# EAGLE schematic ESP_Breakout (EAGLE 9.2.0)
COMPANY: ADAFRUIT INDUSTRIES; DRAWN: KTOWN; REV: B
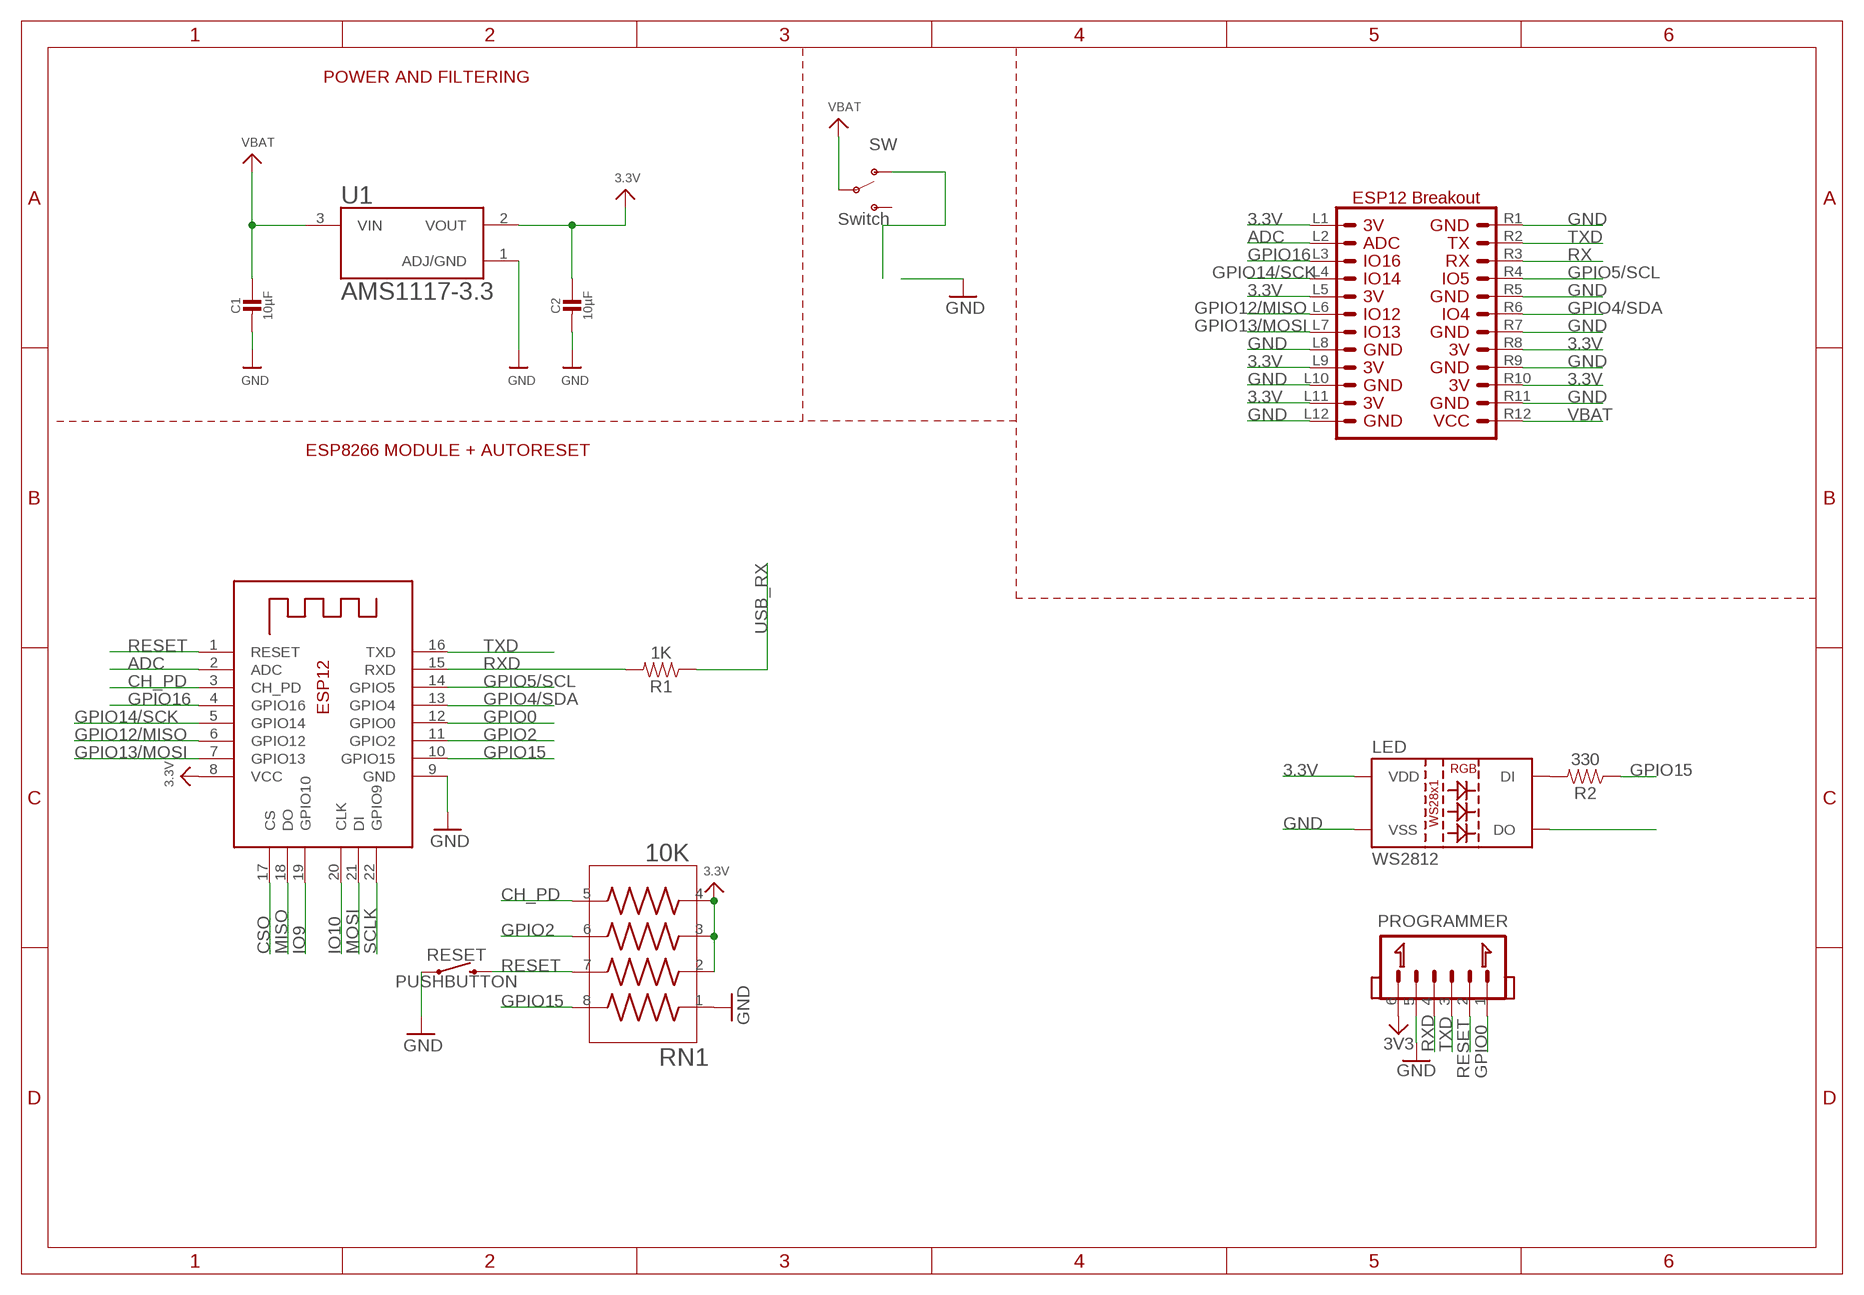
[diagram p0: schematic, sheet 1]

## Parts
C1  10µF  CAP_CERAMIC_0603  [CAP_0603]
C2  10µF  CAP_CERAMIC_0603  [CAP_0603]
LED  WS2812  [LED-TRICOLOR-5050-IC]
PROGRAMMER  JST_1.25_6P  [JST1.25_6P]
R1  1K  RESISTOR0603  [0603]
R2  330  RESISTOR0603  [0603]
RESET  PUSHBUTTON  [TACTILE_SWITCH_SMD_6.0X3.5MM]
RN1  10K  RESISTOR_ARRAY_1206  [RESCAF80P320X160X60-8N]
SW  Switch  SWITCH_SPDT_SLIDE  [SWITCH_SPDT_PTH_11.6X4.0MM]
U1  AMS1117-3.3  [SOT229P700X180-4N]
U$7  ESP12_BREAKOUT  [ESP12_BREAKOUT_CONN]
X2  ESP-12  ESP-12E  [ESP-12E]

## Nets
3.3V: C2.1 LED.VDD PROGRAMMER.6 RN1.2 RN1.3 RN1.4 U1.2(VOUT) U$7.L1 U$7.L5 U$7.L9 U$7.L11 U$7.R8 U$7.R10 X2.8(VCC) ; supply symbol labelled SUPPLY_3.3V
ADC: U$7.L2 X2.2(ADC)
CH_PD: RN1.5 X2.3(CH_PD)
CSO: X2.17(CS)
GND: C1.2 C2.2 LED.VSS PROGRAMMER.5 RESET.1 RN1.1 U1.1(ADJ/GND) U$7.L8 U$7.L10 U$7.L12 U$7.R1 U$7.R5 U$7.R7 U$7.R9 U$7.R11 X2.9(GND) ; supply symbol labelled SUPPLY_GND
GPIO0: PROGRAMMER.1 X2.12(GPIO0)
GPIO2: RN1.6 X2.11(GPIO2)
GPIO4/SDA: U$7.R6 X2.13(GPIO4)
GPIO5/SCL: U$7.R4 X2.14(GPIO5)
GPIO12/MISO: U$7.L6 X2.6(GPIO12)
GPIO13/MOSI: U$7.L7 X2.7(GPIO13)
GPIO14/SCK: U$7.L4 X2.5(GPIO14)
GPIO15: R2.1 RN1.8 X2.10(GPIO15)
GPIO16: U$7.L3 X2.4(GPIO16)
IO9: X2.19(GPIO10)
IO10: X2.20(CLK)
MISO: X2.18(DO)
MOSI: X2.21(DI)
N$1: SW.1(O)
N$2: LED.DIN(DI) R2.2
N$5: LED.DOUT(DO)
RESET: PROGRAMMER.2 RESET.2 RN1.7 X2.1(RESET)
RX: U$7.R3
RXD: PROGRAMMER.4 R1.2 X2.15(RXD)
SCLK: X2.22(GPIO9)
TXD: PROGRAMMER.3 U$7.R2 X2.16(TXD)
USB_RX: R1.1
VBAT: C1.1 SW.2(P) U1.3(VIN) U$7.R12
Unconnected: SW.3(S)

## Notes on the sheet
- POWER AND FILTERING
- ESP8266 MODULE + AUTORESET

## Library data of the parts
C1 C2 = Scott-Electrical:CAP_CERAMIC
LED = AutoPark:WS2812
PROGRAMMER = Scott-Connectors:JST_1.25_6P
R1 R2 = Scott-Electrical:RESISTOR: Generic Resistor Package
RESET = AutoPark:PUSHBUTTON
RN1 = AutoPark:RESISTOR_ARRAY_1206: Res Thick Film Array 75 Ohm 5% 0.25W(1/4W) ?200ppm/C ISOL Molded 8-Pin 1206(4 X 0603) Convex SMD T/R; AVAILABILITY: Unavailable; DESCRIPTION: Res Thick Film Array 75 Ohm 5% 0.25W_1/4W_ ?200ppm/C ISOL Molded 8-Pin 1206_4 X 0603_ Convex SMD T/R; MF: Bourns; MP: CAY16-750J4LF; PACKAGE: 1206 Bourns; PRICE: None
SW = AutoPark:SWITCH_SPDT_SLIDE: 拨动开关SK12D07VG2/3/4/5/6 侧面5脚拨动带支架 3脚2档柄高6MM Taobao <https://item.taobao.com/item.htm?spm=a1z09.2.0.0.53a62e8d0RVocC&id=563254128682&_u=s1po4ce26496> Dimensional Drawing <https://img.alicdn.com/imgextra/i1/2744920356/TB2568GkMDD8KJjy0FdXXcjvXXa_!!2744920356.jpg>
U1 = AutoPark:AMS1117-3.3: Sot223/Pkg 1-Amp 3.3-Volt Low Drop Out Voltage Regulatator; AVAILABILITY: Unavailable; DESCRIPTION: Sot223/Pkg 1-Amp 3.3-Volt Low Drop Out Voltage Regulatator; MF: Advanced Monolithic Systems; MP: AMS1117-3.3; PACKAGE: None; PRICE: None
U$7 = AutoPark:ESP12_BREAKOUT
X2 = microbuilder:ESP-12E

## Net classes
1 power: width 0.178 mm